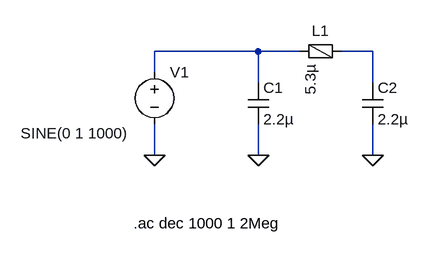
[diagram p0: schematic Draft1.asc]
Draft1.asc, the LTspice schematic file:
Version 4
SHEET 1 880 680
WIRE 336 240 176 240
WIRE 400 240 336 240
WIRE 512 240 464 240
WIRE 176 272 176 240
WIRE 336 288 336 240
WIRE 512 288 512 240
WIRE 176 400 176 352
WIRE 336 400 336 352
WIRE 512 400 512 352
FLAG 336 400 0
FLAG 512 400 0
FLAG 176 400 0
SYMBOL FerriteBead 432 240 R90
WINDOW 0 -16 0 VBottom 2
SYMATTR InstName L1
SYMATTR Value 5.3µ
SYMATTR SpiceLine Ipk=1 Rser=172m Rpar=1.08K Cpar=1.3p mfg="Würth Elektronik" pn="742792096 WE-CBF 0805"
SYMBOL cap 320 288 R0
SYMATTR InstName C1
SYMATTR Value 2.2µ
SYMATTR SpiceLine Rser=13.8m Lser=0 mfg="KEMET" pn="C1206C225K3PAC" type="X5R"
SYMBOL voltage 176 256 R0
WINDOW 3 -206 110 Left 2
SYMATTR InstName V1
SYMATTR Value SINE(0 1 1000)
SYMATTR Value2 AC 1
SYMBOL cap 496 288 R0
SYMATTR InstName C2
SYMATTR Value 2.2µ
SYMATTR SpiceLine Rser=13.8m Lser=0 mfg="KEMET" pn="C1206C225K3PAC" type="X5R"
TEXT 144 504 Left 2 !.ac dec 1000 1 2Meg

The netlist it stands for:
* Draft1.asc
L1 N002 N001 5.3µ Ipk=1 Rser=172m Rpar=1.08K Cpar=1.3p mfg="Würth Elektronik" pn="742792096 WE-CBF 0805"
C1 N001 0 2.2µ Rser=13.8m Lser=0 mfg="KEMET" pn="C1206C225K3PAC" type="X5R"
V1 N001 0 SINE(0 1 1000) AC 1
C2 N002 0 2.2µ Rser=13.8m Lser=0 mfg="KEMET" pn="C1206C225K3PAC" type="X5R"
.ac dec 1000 1 2Meg
.backanno
.end